# Altium schematic sheet Controller.SchDoc
size A2
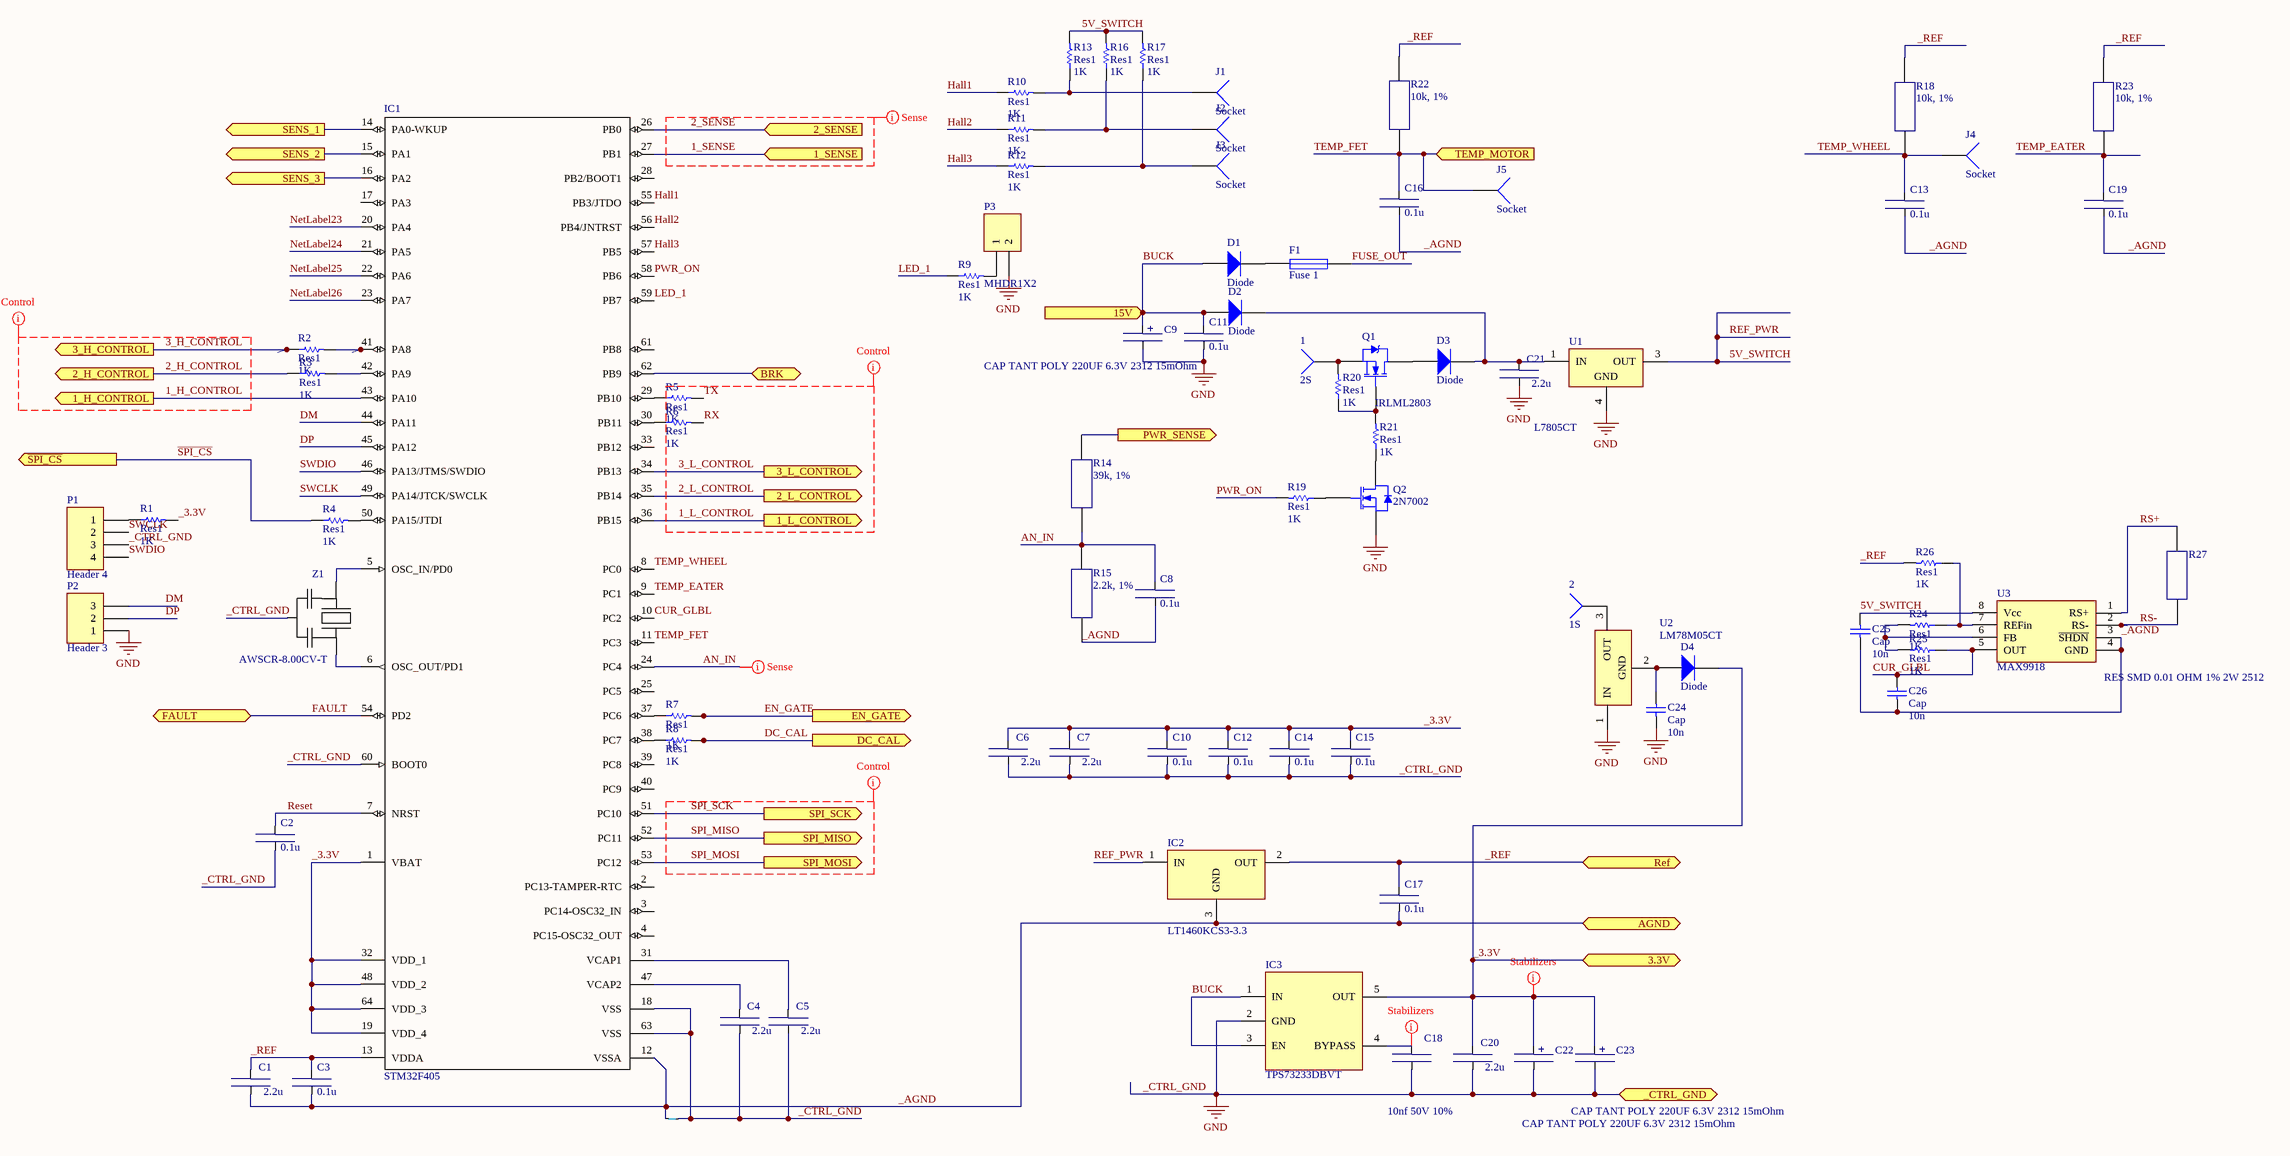
[diagram p0: Controller.SchDoc]

## Parts
1  2S  [PIN1]
2  1S  [PIN1]
C1  2.2u  [ERA-0603]
C2  0.1u  [CAPC1608X08N(0603)]
C3  0.1u  [ERA-0603]
C4  2.2u  [CAPC1608X08N(0603)]
C5  2.2u  [CAPC1608X08N(0603)]
C6  2.2u  [CAPC1608X08N(0603)]
C7  2.2u  [CAPC1608X08N(0603)]
C8  0.1u  [0603x]
C9  CAP TANT POLY 220UF 6.3V 2312 15mOhm  [CAP_POLY_330]
C10  0.1u  [CAPC1608X08N(0603)]
C11  0.1u  [ERA-0603]
C12  0.1u  [CAPC1608X08N(0603)]
C13  0.1u  [0603x]
C14  0.1u  [CAPC1608X08N(0603)]
C15  0.1u  [CAPC1608X08N(0603)]
C16  0.1u  [CAPC1608X08N(0603)]
C17  0.1u  [0603x]
C18  10nf 50V 10%  [0603x]
C19  0.1u  [0603x]
C20  2.2u  [CAPC1608X08N(0603)]
C21  2.2u  [0603x]
C22  CAP TANT POLY 220UF 6.3V 2312 15mOhm  [C]
C23  CAP TANT POLY 220UF 6.3V 2312 15mOhm  [CAP_POLY_330]
C24  Cap  value 10n  [ERA-0603]
C25  Cap  value 10n  [ERA-0603]
C26  Cap  value 10n  [ERA-0603]
D1  Diode  [SMB_real]
D2  Diode  [SMA]
D3  Diode  [SMA]
D4  Diode  [SMA]
F1  Fuse 1  [1812]
IC1  STM32F405  [LQFP64_L]
IC2  LT1460KCS3-3.3  [SOT23-3_L]
IC3  TPS73233DBVT  [SOT23-5_L]
J1  Socket  [PIN1]
J2  Socket  [PIN1]
J3  Socket  [PIN1]
J4  Socket  [PIN1]
J5  Socket  [PIN1]
NT1  NET_TIE  [NET_TIE_10mil]  (value not drawn)  (net tie, no BOM)
P1  Header 4  [MHDR1X4]
P2  Header 3  [HDR1X3]
P3  MHDR1X2  [MHDR1X2]
Q1  IRLML2803  [SOT-23_N]
Q2  2N7002  [SOT23_N]
R1  Res1  value 1K  [0603x]
R2  Res1  value 1K  [1206x]
R3  Res1  value 1K  [0603x]
R4  Res1  value 1K  [0603x]
R5  Res1  value 1K  [0402x]
R6  Res1  value 1K  [0402x]
R7  Res1  value 1K  [0805x]
R8  Res1  value 1K  [0603x]
R9  Res1  value 1K  [0603x]
R10  Res1  value 1K  [0603x]
R11  Res1  value 1K  [0603x]
R12  Res1  value 1K  [0603x]
R13  Res1  value 1K  [0603x]
R14  39k, 1%  [1206x]
R15  2.2k, 1%  [0603x]
R16  Res1  value 1K  [0603x]
R17  Res1  value 1K  [0603x]
R18  10k, 1%  [0603x]
R19  Res1  value 1K  [0603x]
R20  Res1  value 1K  [0603x]
R21  Res1  value 1K  [0603x]
R22  10k, 1%  [RESC1608X05N(0603)]
R23  10k, 1%  [0603x]
R24  Res1  value 1K  [0603x]
R25  Res1  value 1K  [0603x]
R26  Res1  value 1K  [0603x]
R27  RES SMD 0.01 OHM 1% 2W 2512  [1T-2512]
U1  L7805CT  [TO-252AA]
U2  LM78M05CT  [318-08]
U3  MAX9918  [SO8_M]
Z1  AWSCR-8.00CV-T  [CRYSTAL_CERAMIC]

## Ports
1_H_CONTROL (out), 1_L_CONTROL (out), 1_SENSE (in), 2_H_CONTROL (out), 2_L_CONTROL (out), 2_SENSE (in), 3.3V, 3_H_CONTROL (out), 3_L_CONTROL (out), 15V (in), _CTRL_GND, AGND, BRK, DC_CAL (out), EN_GATE (out), FAULT, PWR_SENSE (out), Ref, SENS_1 (out), SENS_2 (out), SENS_3 (out), SPI_MISO (out), SPI_MOSI (out), SPI_SCK (out), TEMP_MOTOR (in), ~{SPI_CS} (out)

## Nets
_CTRL_GND: C2.2 C4.2 C5.2 C6.2 C7.2 C9.2 C10.2 C11.2 C12.2 C14.2 C15.2 C18.2 C20.2 C21.2 C22.2 C23.2 C24.2 IC1.18(VSS) IC1.60(BOOT0) IC1.63(VSS) IC3.2(GND) NT1.2 P1.3 P2.1 P3.2 Q2.2(S) U1.4(GND) U2.1(IN) Z1.2(GND) ; port _CTRL_GND  [also labelled GND]
1_H_CONTROL: IC1.43(PA10) ; port 1_H_CONTROL
1_L_CONTROL: IC1.36(PB15) ; port 1_L_CONTROL
1_SENSE: IC1.27(PB1) ; port 1_SENSE
2_H_CONTROL: R3.1 ; port 2_H_CONTROL
2_L_CONTROL: IC1.35(PB14) ; port 2_L_CONTROL
2_SENSE: IC1.26(PB0) ; port 2_SENSE
3_H_CONTROL: R2.1 ; port 3_H_CONTROL
3_L_CONTROL: IC1.34(PB13) ; port 3_L_CONTROL
5V_SWITCH: C25.1 IC2.1(IN) R13.2 R16.2 R17.2 U1.3(OUT) U3.8(Vcc)  [also labelled REF_PWR]
_3.3V: C6.1 C7.1 C10.1 C12.1 C14.1 C15.1 C20.1 C22.1 C23.1 D4.2(K) IC1.1(VBAT) IC1.19(VDD_4) IC1.32(VDD_1) IC1.48(VDD_2) IC1.64(VDD_3) IC3.5(OUT) R1.2 ; port 3.3V
_AGND: C1.2 C3.2 C8.2 C13.2 C16.2 C17.2 C19.2 C25.2 C26.2 IC1.12(VSSA) IC2.3(GND) NT1.1 R15.2 U3.3(~{SHDN}) U3.4(GND) ; port AGND
_REF: C1.1 C3.1 C17.1 IC1.13(VDDA) IC2.2(OUT) R18.1 R22.1 R23.1 R26.2 ; port Ref
AN_IN: C8.1 IC1.24(PC4) R14.2 R15.1
BRK: IC1.62(PB9) ; port BRK
BUCK: C9.1 C11.1 D1.1(A) D2.1(A) IC3.1(IN) IC3.3(EN) ; port 15V
CUR_GLBL: C26.1 IC1.10(PC2) R25.1 U3.5(OUT)
DC_CAL: R8.2 ; port DC_CAL
DM: IC1.44(PA11) P2.3
DP: IC1.45(PA12) P2.2
EN_GATE: R7.2 ; port EN_GATE
FAULT: IC1.54(PD2) ; port FAULT
FUSE_OUT: F1.2
Hall1: IC1.55(PB3/JTDO) R10.1
Hall2: IC1.56(PB4/JNTRST) R11.1
Hall3: IC1.57(PB5) R12.1
LED_1: IC1.59(PB7) R9.1
NetLabel23: IC1.20(PA4)
NetLabel24: IC1.21(PA5)
NetLabel25: IC1.22(PA6)
NetLabel26: IC1.23(PA7)
PWR_ON: IC1.58(PB6) R19.2
PWR_SENSE: R14.1 ; port PWR_SENSE
Reset: C2.1 IC1.7(NRST)
RS+: R27.1 U3.1(RS+)
RS-: R27.2 U3.2(RS-)
RX: R6.2
~{SPI_CS}: R4.1 ; port ~{SPI_CS}
SENS_1: IC1.14(PA0-WKUP) ; port SENS_1
SENS_2: IC1.15(PA1) ; port SENS_2
SENS_3: IC1.16(PA2) ; port SENS_3
SPI_MISO: IC1.52(PC11) ; port SPI_MISO
SPI_MOSI: IC1.53(PC12) ; port SPI_MOSI
SPI_SCK: IC1.51(PC10) ; port SPI_SCK
SWCLK: IC1.49(PA14/JTCK/SWCLK) P1.2
SWDIO: IC1.46(PA13/JTMS/SWDIO) P1.4
TEMP_EATER: C19.1 IC1.9(PC1) R23.2
TEMP_FET: C16.1 IC1.11(PC3) J5.1 R22.2 ; port TEMP_MOTOR
TEMP_WHEEL: C13.1 IC1.8(PC0) J4.1 R18.2
TX: R5.2
Net1_1: 1.1 Q1.2(S) R20.2
Net2_1: 2.1 U2.3(OUT)
NetC4_1: C4.1 IC1.47(VCAP2)
NetC5_1: C5.1 IC1.31(VCAP1)
NetC18_1: C18.1 IC3.4(BYPASS)
NetC21_1: C21.1 D2.2(K) D3.2(K) U1.1(IN)
NetC24_1: C24.1 D4.1(A) U2.2(GND)
NetD1_2: D1.2(K) F1.1
NetD3_1: D3.1(A) Q1.3(D)
NetIC1_5: IC1.5(OSC_IN/PD0) Z1.1(X1)
NetIC1_6: IC1.6(OSC_OUT/PD1) Z1.3(X2)
NetIC1_29: IC1.29(PB10) R5.1
NetIC1_30: IC1.30(PB11) R6.1
NetIC1_37: IC1.37(PC6) R7.1
NetIC1_38: IC1.38(PC7) R8.1
NetIC1_41: IC1.41(PA8) R2.2
NetIC1_42: IC1.42(PA9) R3.2
NetIC1_50: IC1.50(PA15/JTDI) R4.2
NetJ1_1: J1.1 R10.2 R13.1
NetJ2_1: J2.1 R11.2 R16.1
NetJ3_1: J3.1 R12.2 R17.1
NetP1_1: P1.1 R1.1
NetP3_1: P3.1 R9.2
NetQ1_1: Q1.1(G) R20.1 R21.2
NetQ2_1: Q2.1(G) R19.1
NetQ2_3: Q2.3(D) R21.1
NetR24_1: R24.1 R26.1 U3.7(REFin)
NetR24_2: R24.2 R25.2 U3.6(FB)

Not connected (* = marked no-connect by the designer): IC1 2(PC13-TAMPER-RTC) 3(PC14-OSC32_IN) 4(PC15-OSC32_OUT) 17(PA3) 25(PC5) 28(PB2/BOOT1) 33(PB12) 39(PC8) 40(PC9) 61(PB8)

## Layout directives
net class Stabilizers: _3.3V, NetC18_1
net class Control: 1_H_CONTROL, 1_L_CONTROL, 2_H_CONTROL, 2_L_CONTROL, 3_H_CONTROL, 3_L_CONTROL, RX, SPI_MISO, SPI_MOSI, SPI_SCK, TX
net class Sense: 1_SENSE, 2_SENSE, AN_IN

## Notes on the sheet
- Title
- Size:
- Date:
- File:
- A2
- Number:
- Time:
- Revision:
- Sheet
- of

## Library data of the parts
1 2 = Socket: LatestRevisionDate: 17-Jul-2002; LatestRevisionNote: Re-released for DXP Platform.; Publisher: Altium Limited
C1 C4-C7 C20 C21 = Ceramic Chip Capacitor: Value: CAP CER 2.2UF 25V X5R 0603; Order Number: GRM188R61E225KA12D; Distributor: Murata Electronics; Package: CAPC1608X08N(0603)
C2 C3 C8 C10-C17 C19 = Ceramic Chip Capacitor: Value: CAP CER 0.1UF 50V X7R 0603; Order Number: 06035C104KAT2A; Distributor: AVX Corporation
  C2 C3 C8 C11 C13 C16 C17 C19: Package: 0603
  C10 C12 C14 C15: Package: CAPC1608X08N(0603)
C9 C22 C23 = Tantalum Chip Capacitor: Order Number: T520C227M006ATE015; Value: CAP TANT POLY 220UF 6.3V 2312 15mOhm; Package: C; Distributor: KEMET
C18 = Ceramic Chip Capacitor: Value: CAP CER 10000PF 50V X7R 0402; Order Number: CGA2B3X7R1H103K050BD; Distributor: TDK Corporation; Package: 0402
C24-C26 = Cap: Capacitor; Published: 8-Jun-2000; LatestRevisionDate: 17-Jul-2002; LatestRevisionNote: Re-released for DXP Platform.; PackageReference: RAD-0.3; Publisher: Altium Limited; PackageDescription: Radial Cap, Thru-Hole; 2 Leads; 0.3 in Pin Spacing
D1-D4 = Diode: Default Diode; Published: 8-Jun-2000; LatestRevisionDate: 17-Jul-2002; LatestRevisionNote: Re-released for DXP Platform.; PackageVersion: Sep-1996; PackageReference: SMC; Publisher: Altium Limited; PackageDescription: DO-214-AB/SMC; 2 C-Bend Leads; Body 7.9 x 5.9 mm, inc. leads (LxW); Code_JEDEC: DO-214-AB
F1 = Fuse 1: Fuse; Published: 8-Jun-2000; LatestRevisionDate: 17-Jul-2002; LatestRevisionNote: Re-released for DXP Platform.; PackageReference: PIN-W2/E2.8; Publisher: Altium Limited; PackageDescription: Thru-Hole; 2 Leads
IC1 = STM32F405: STM32 ARM-based 32-bit MCU; Order Number: STM32F405RGT6; Value: STM32F405RGT6; Package: LQFP-64; Distributor: STMicroelectronics
IC2 = PreciseRef: Value: Voltage reference 3.3V 0.5% 50ppm/C; Order Number: LT1460KCS3-3.3#TRMPBF; Distrubutor: Linear Technology; Package: SOT23
IC3 = TPS7xx33: Value: LDO 3.3V 250mA; Order Number: TPS73233DBVT; Distributor: Texas Instruments; Package: SOT23-5
NT1 = Net tie
P1 = Header 4: Header, 4-Pin; LatestRevisionDate: 17-Jul-2002; LatestRevisionNote: Re-released for DXP Platform.; Publisher: Altium Limited
P2 = Header 3: Header, 3-Pin; LatestRevisionDate: 17-Jul-2002; LatestRevisionNote: Re-released for DXP Platform.; Publisher: Altium Limited
P3 = MHDR1X2: Header, 2-Pin; LatestRevisionDate: 17-Jul-2002; LatestRevisionNote: Re-released for DXP Platform.; Publisher: Altium Limited
Q1 = IRLML2803: HEXFET Power MOSFET; Published: 8-Jun-2000; LatestRevisionDate: 20-Nov-2009; LatestRevisionNote: IPC-7351 Footprint Added.; DatasheetVersion: Aug-1997; PackageReference: SOT-23; Publisher: Altium Limited; PackageDescription: 3-Pin SOT-23 Package 0.95 mm Pitch, 2.3 mm Lead Span; ComponentLink1Description: Manufacturer Link; ComponentLink1URL: http://www.irf.com/; ComponentLink2Description: Datasheet; ComponentLink2URL: http://www.irf.com/product-info/datasheets/data/irlml2803.pdf
Q2 = 2N7002: N-channel Enhancement Mode Field-effect Transistor; Published: 17-Sep-2003; LatestRevisionDate: 12-Dec-2006; LatestRevisionNote: IPC-7351 Footprint Added.; DatasheetVersion: 27-Jul-2000; PackageVersion: May-1999; PackageReference: SOT23; Publisher: Altium Limited; PackageDescription: 3-Pin SOT-23 Package 0.95 mm Pitch, 2.3 mm Lead Span; ComponentLink1Description: Manufacturer Link; ComponentLink1URL: http://www.semiconductors.philips.com/; ComponentLink2Description: Datasheet; ComponentLink2URL: http://www.semiconductors.philips.com/acrobat/datasheets/2N7002_4.pdf
R1-R13 R16 R17 R19-R21 R24-R26 = Res1: Resistor; Published: 8-Jun-2000; LatestRevisionDate: 17-Jul-2002; LatestRevisionNote: Re-released for DXP Platform.; PackageReference: AXIAL-0.3; Publisher: Altium Limited; PackageDescription: Axial Device, Thru-Hole; 2 Leads; 0.3 in Pin Spacing
R14 = SMD: Value: RES SMD 39K OHM 1% 1/10W 0603; Order Number: ERJ-3EKF3902V; Package: RESC1608X05N(0603); Distributor: Panasonic
R15 = SMD: Value: RES SMD 2.2K OHM 1% 1/10W 0603; Order Number: ERJ-3EKF2201V; Package: RESC1608X05N(0603); Distributor: Panasonic
R18 R22 R23 = SMD: Value: RES SMD 10K OHM 1% 1/10W 0603; Order Number: ERJ-3EKF1002V; Package: RESC1608X05N(0603); Distributor: Panasonic
R27 = SMD: Order Number: WSL2512R0100FEA; Value: RES SMD 0.01 OHM 1% 2W 2512; Package: 2512; Distributor: Vishay Dale
U1 = L7805CT: Positive Voltage Regulator; Published: 24-Aug-2001; LatestRevisionDate: 17-Jul-2002; LatestRevisionNote: Re-released for DXP Platform.; DatasheetVersion: Dec-1998; PackageReference: TO-3R; Publisher: Altium Limited; PackageDescription: Oval Flange Mount with (2) Offset Leads; Pin Spacing 10.92 mm; Lead Dia. 1.1 mm (max); ComponentLink1Description: Manufacturer Link; ComponentLink1URL: http://www.st.com/; ComponentLink2Description: Datasheet; ComponentLink2URL: http://www.st.com/stonline/products/literature/ds/2144/l7805ab.pdf
U2 = LM78M05CT: 3-Terminal Positive Voltage Regulators, 3-pin TO-220; Manufacturer: National Semiconductor; PackageTopMarking: NSUZXYTTE#*LM341T-5.0*LM78M05CT; PowerWise: N; CompType: LDO IC; Published: 4-Dec-2008; DatasheetVersion: Aug-2005; PackageVersion: revL, Jan-1992; PackageReference: T03B; Publisher: Altium Limited; PackageDescription: TO-220, Molded, 3 Lead, Straight; Supplier 1: Farnell; Supplier Part Number 1: 4467103; PartNumber: LM78M05CT; RoHS: N; PinCount: 3; ComponentLink1Description: LM78M05 Datasheet; ComponentLink1URL: http://www.national.com/ds/LM/LM78M05.pdf; ComponentLink2Description: LM78M05 Web Page; ComponentLink2URL: http://www.national.com/pf/LM/LM78M05.html; ComponentLink3Description: T03B Package Page; ComponentLink3URL: http://www.national.com/packaging/folders/t03b.html
Z1 = Crystal_smd_with_caps: Value: CER RES 8.0000MHZ 22PF SMD; Order Number: AWSCR-8.00CV-T; Distributor: Abracon LLC; Package: 3-SMD, Non-Standard
J1-J5 = Socket: LatestRevisionDate: 17-Jul-2002; LatestRevisionNote: Re-released for DXP Platform.; Publisher: Altium Limited